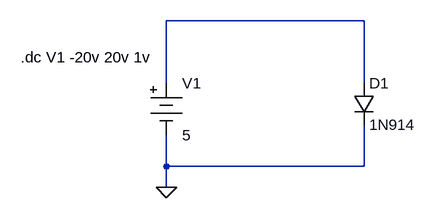
[diagram p0: schematic Yoneda-p82.asc]
Yoneda-p82.asc, the LTspice schematic file:
Version 4
SHEET 1 880 680
WIRE 400 -16 96 -16
WIRE 96 80 96 -16
WIRE 400 80 400 -16
WIRE 96 208 96 160
WIRE 400 208 400 144
WIRE 400 208 96 208
WIRE 96 240 96 208
FLAG 96 240 0
SYMBOL diode 384 80 R0
SYMATTR InstName D1
SYMATTR Value 1N914
SYMBOL Misc\\battery 96 64 R0
SYMATTR InstName V1
SYMATTR Value 5
TEXT -128 40 Left 2 !.dc V1 -20v 20v 1v

The netlist it stands for:
* Yoneda-p82.asc
D1 N001 0 1N914
V1 N001 0 5
.model D D
.lib standard.dio
.dc V1 -20v 20v 1v
.backanno
.end